# EAGLE schematic Shruthi-Analog-CS80-SVF-v01_xml (EAGLE 7.3.0)
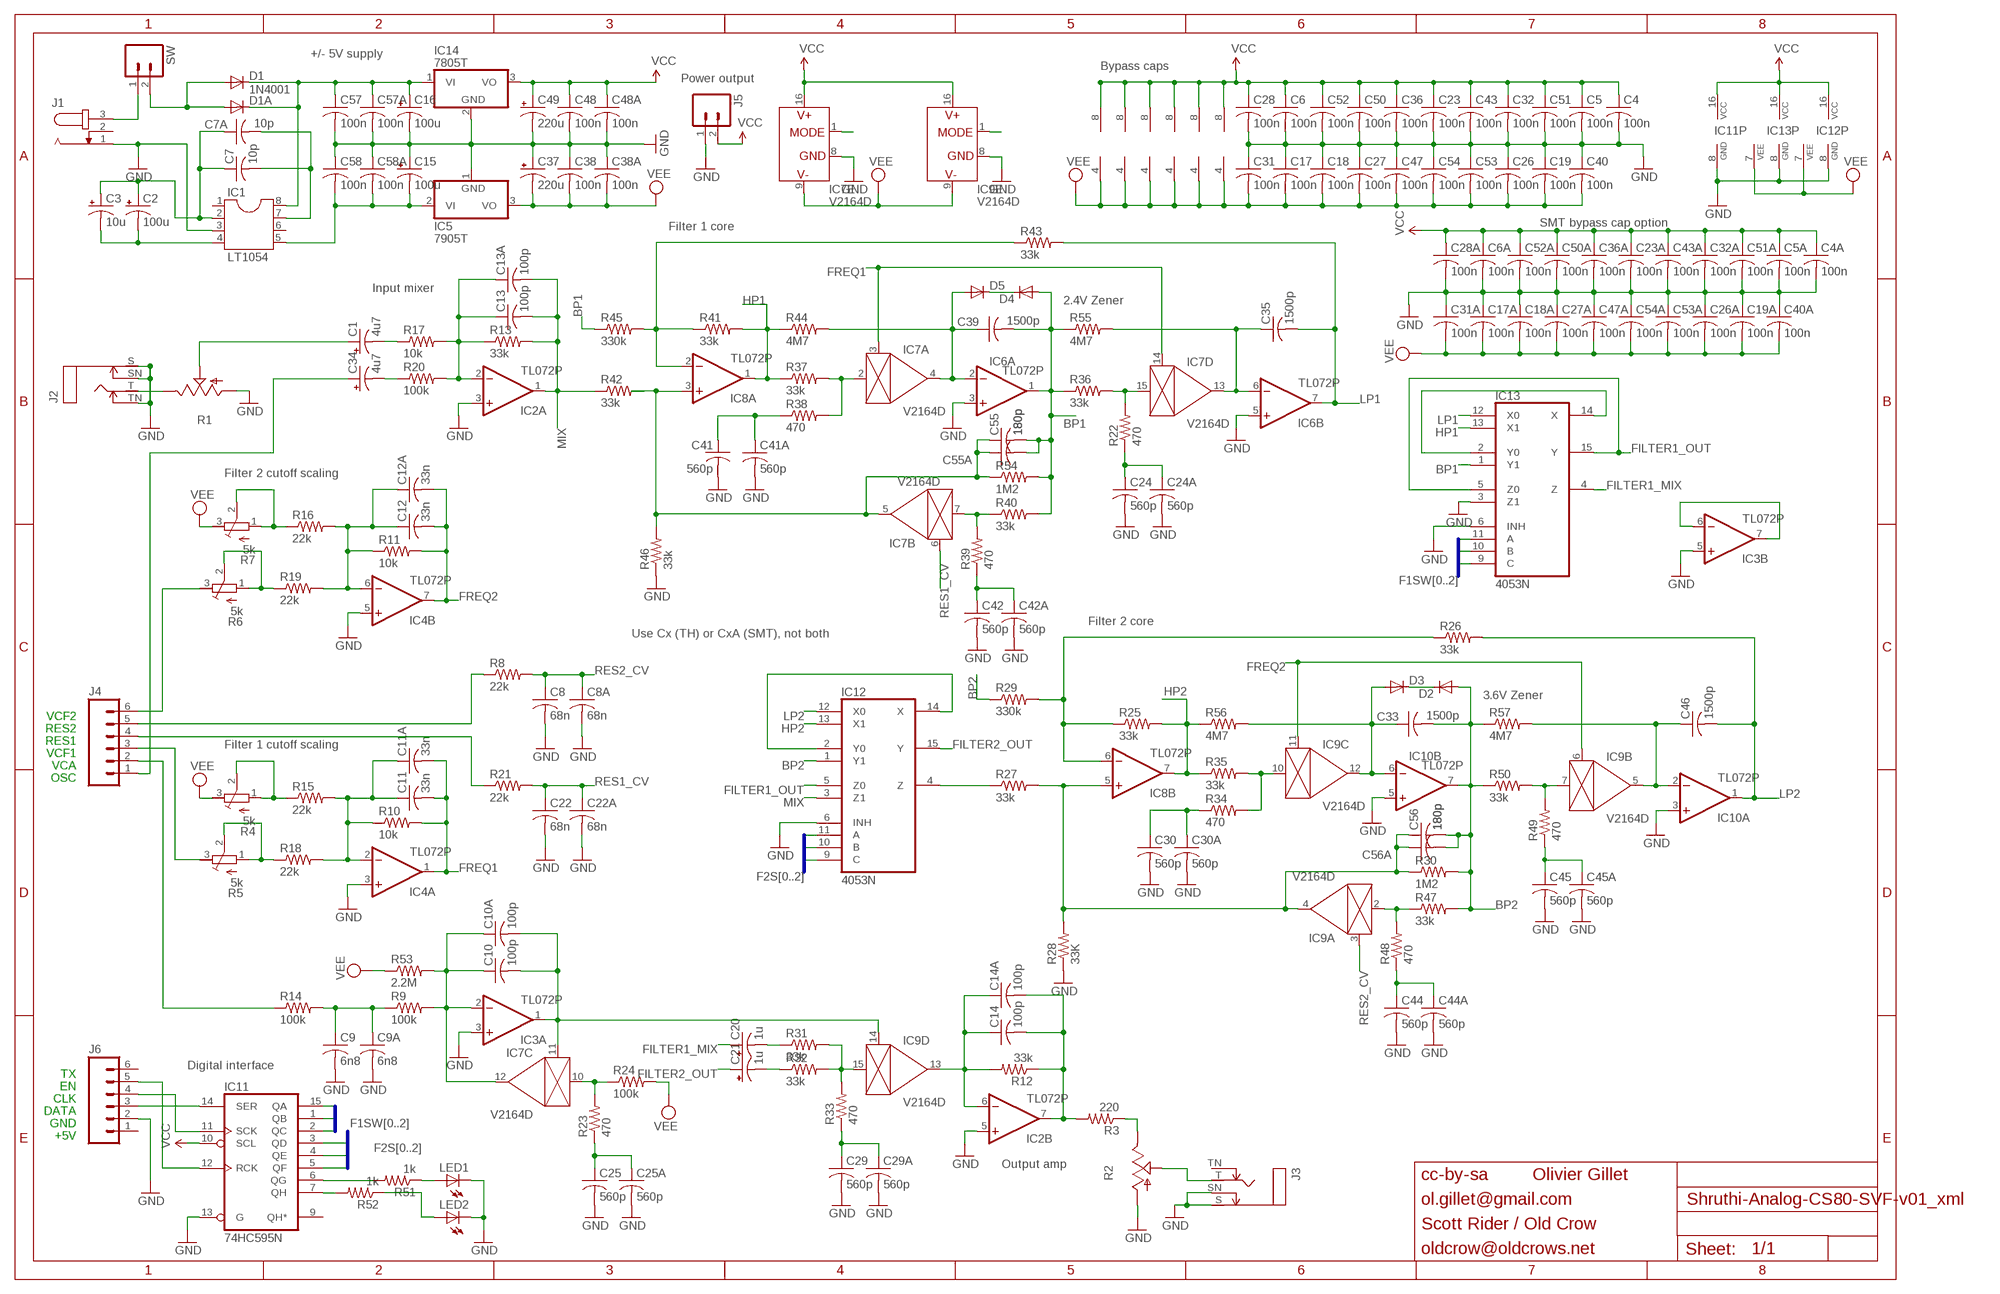
[diagram p0: schematic, sheet 1]

## Parts
C1  4u7  CPOL-USE2.5-6  [E2,5-6]
C2  100u  CPOL-USE2.5-6  [E2,5-6]
C3  10u  CPOL-USE2.5-5  [E2,5-5]
C4  100n  C-US050-025X075  [C050-025X075]
C4A  100n  C-USC0805K  [C0805K]
C5  100n  C-US050-025X075  [C050-025X075]
C5A  100n  C-USC0805K  [C0805K]
C6  100n  C-US050-025X075  [C050-025X075]
C6A  100n  C-USC0805K  [C0805K]
C7  10p  C-US050-025X075  [C050-025X075]
C7A  10p  C-USC0805K  [C0805K]
C8  68n  C-US050-025X075  [C050-025X075]
C8A  68n  C-USC0805K  [C0805K]
C9  6n8  C-US050-025X075  [C050-025X075]
C9A  6n8  C-USC0805K  [C0805K]
C10  100p  C-US050-025X075  [C050-025X075]
C10A  100p  C-USC0805K  [C0805K]
C11  33n  C-US050-025X075  [C050-025X075]
C11A  33n  C-USC0805K  [C0805K]
C12  33n  C-US050-025X075  [C050-025X075]
C12A  33n  C-USC0805K  [C0805K]
C13  100p  C-US050-025X075  [C050-025X075]
C13A  100p  C-USC0805K  [C0805K]
C14  100p  C-US050-025X075  [C050-025X075]
C14A  100p  C-USC0805K  [C0805K]
C15  100u  CPOL-USE2.5-7  [E2,5-7]
C16  100u  CPOL-USE2.5-7  [E2,5-7]
C17  100n  C-US050-025X075  [C050-025X075]
C17A  100n  C-USC0805K  [C0805K]
C18  100n  C-US050-025X075  [C050-025X075]
C18A  100n  C-USC0805K  [C0805K]
C19  100n  C-US050-025X075  [C050-025X075]
C19A  100n  C-USC0805K  [C0805K]
C20  1u  CPOL-USE2-5  [E2-5]
C21  1u  CPOL-USE2-5  [E2-5]
C22  68n  C-US050-025X075  [C050-025X075]
C22A  68n  C-USC0805K  [C0805K]
C23  100n  C-US050-025X075  [C050-025X075]
C23A  100n  C-USC0805K  [C0805K]
C24  560p  C-US050-025X075  [C050-025X075]
C24A  560p  C-USC0805K  [C0805K]
C25  560p  C-US050-025X075  [C050-025X075]
C25A  560p  C-USC0805K  [C0805K]
C26  100n  C-US050-025X075  [C050-025X075]
C26A  100n  C-USC0805K  [C0805K]
C27  100n  C-US050-025X075  [C050-025X075]
C27A  100n  C-USC0805K  [C0805K]
C28  100n  C-US050-025X075  [C050-025X075]
C28A  100n  C-USC0805K  [C0805K]
C29  560p  C-US050-025X075  [C050-025X075]
C29A  560p  C-USC0805K  [C0805K]
C30  560p  C-US050-025X075  [C050-025X075]
C30A  560p  C-USC0805K  [C0805K]
C31  100n  C-US050-025X075  [C050-025X075]
C31A  100n  C-USC0805K  [C0805K]
C32  100n  C-US050-025X075  [C050-025X075]
C32A  100n  C-USC0805K  [C0805K]
C33  1500p  C-US025-025X050  [C025-025X050]
C34  4u7  CPOL-USE2.5-6  [E2,5-6]
C35  1500p  C-US025-025X050  [C025-025X050]
C36  100n  C-US050-025X075  [C050-025X075]
C36A  100n  C-USC0805K  [C0805K]
C37  220u  CPOL-USE3.5-8  [E3,5-8]
C38  100n  C-US050-025X075  [C050-025X075]
C38A  100n  C-USC0805K  [C0805K]
C39  1500p  C-US025-025X050  [C025-025X050]
C40  100n  C-US050-025X075  [C050-025X075]
C40A  100n  C-USC0805K  [C0805K]
C41  560p  C-US050-025X075  [C050-025X075]
C41A  560p  C-USC0805K  [C0805K]
C42  560p  C-US050-025X075  [C050-025X075]
C42A  560p  C-USC0805K  [C0805K]
C43  100n  C-US050-025X075  [C050-025X075]
C43A  100n  C-USC0805K  [C0805K]
C44  560p  C-US050-025X075  [C050-025X075]
C44A  560p  C-USC0805K  [C0805K]
C45  560p  C-US050-025X075  [C050-025X075]
C45A  560p  C-USC0805K  [C0805K]
C46  1500p  C-US025-025X050  [C025-025X050]
C47  100n  C-US050-025X075  [C050-025X075]
C47A  100n  C-USC0805K  [C0805K]
C48  100n  C-US050-025X075  [C050-025X075]
C48A  100n  C-USC0805K  [C0805K]
C49  220u  CPOL-USE3.5-8  [E3,5-8]
C50  100n  C-US050-025X075  [C050-025X075]
C50A  100n  C-USC0805K  [C0805K]
C51  100n  C-US050-025X075  [C050-025X075]
C51A  100n  C-USC0805K  [C0805K]
C52  100n  C-US050-025X075  [C050-025X075]
C52A  100n  C-USC0805K  [C0805K]
C53  100n  C-US025-025X050  [C025-025X050]
C53A  100n  C-USC0805K  [C0805K]
C54  100n  C-US050-025X075  [C050-025X075]
C54A  100n  C-USC0805K  [C0805K]
C55  180p  C-US050-025X075  [C050-025X075]
C55A  180p  C-USC0805K  [C0805K]
C56  180p  C-US050-025X075  [C050-025X075]
C56A  180p  C-USC0805K  [C0805K]
C57  100n  C-US050-025X075  [C050-025X075]
C57A  100n  C-USC0805K  [C0805K]
C58  100n  C-US050-025X075  [C050-025X075]
C58A  100n  C-USC0805K  [C0805K]
D1  1N4001  1N4004  [DO41-10]
D1A  DIODE-SMB  [SMB]
D2  DIODE-D-5  [D-5]
D3  DIODE-D-5  [D-5]
D4  DIODE-D-5  [D-5]
D5  DIODE-D-5  [D-5]
IC1  LT1054  DIL8  [DIL08]
IC2  TL072P  [DIL08]
IC3  TL072P  [DIL08]
IC4  TL072P  [DIL08]
IC5  7905T  [TO220H]
IC6  TL072P  [DIL08]
IC7  V2164D  SSM2164P  [DIL16]
IC8  TL072P  [DIL08]
IC9  V2164D  SSM2164P  [DIL16]
IC10  TL072P  [DIL08]
IC11  74HC595N  [DIL16]
IC12  4053N  [DIL16]
IC13  4053N  [DIL16]
IC14  7805T  [TO220H]
J1  JACK-PLUG2  [SPC4078_BIG_HOLES]
J2  MONOSWS  [NMJ4HC-S]
J3  MONOSWS  [NMJ4HC-S]
J4  M06SIP  [1X06]
J5  M02PTH  [1X02]
J6  M06SIP  [1X06]
LED1  LEDCHIP-LED0603  [CHIP-LED0603]
LED2  LEDCHIP-LED0603  [CHIP-LED0603]
R1  POT_USCABLED  [CABLE_POT_6MM]
R2  POT_USCABLED  [CABLE_POT_6MM]
R3  220  R-US_0204/7  [0204/7]
R4  5k  R-TRIMM3296X  [RTRIM3296X]
R5  5k  R-TRIMM3296X  [RTRIM3296X]
R6  5k  R-TRIMM3296X  [RTRIM3296X]
R7  5k  R-TRIMM3296X  [RTRIM3296X]
R8  22k  R-US_0204/7  [0204/7]
R9  100k  R-US_0204/7  [0204/7]
R10  10k  R-US_0204/7  [0204/7]
R11  10k  R-US_0204/7  [0204/7]
R12  33k  R-US_0204/7  [0204/7]
R13  33k  R-US_0204/7  [0204/7]
R14  100k  R-US_0204/7  [0204/7]
R15  22k  R-US_0204/7  [0204/7]
R16  22k  R-US_0204/7  [0204/7]
R17  10k  R-US_0204/7  [0204/7]
R18  22k  R-US_0204/7  [0204/7]
R19  22k  R-US_0204/7  [0204/7]
R20  100k  R-US_0204/7  [0204/7]
R21  22k  R-US_0204/7  [0204/7]
R22  470  R-US_0204/7  [0204/7]
R23  470  R-US_0204/7  [0204/7]
R24  100k  R-US_0204/7  [0204/7]
R25  33k  R-US_0204/7  [0204/7]
R26  33k  R-US_0204/7  [0204/7]
R27  33k  R-US_0204/7  [0204/7]
R28  33K  R-US_0204/7  [0204/7]
R29  330k  R-US_0204/7  [0204/7]
R30  1M2  R-US_0204/7  [0204/7]
R31  33k  R-US_0204/7  [0204/7]
R32  33k  R-US_0204/7  [0204/7]
R33  470  R-US_0204/7  [0204/7]
R34  470  R-US_0204/7  [0204/7]
R35  33k  R-US_0204/7  [0204/7]
R36  33k  R-US_0204/7  [0204/7]
R37  33k  R-US_0204/7  [0204/7]
R38  470  R-US_0204/7  [0204/7]
R39  470  R-US_0204/7  [0204/7]
R40  33k  R-US_0204/7  [0204/7]
R41  33k  R-US_0204/7  [0204/7]
R42  33k  R-US_0204/7  [0204/7]
R43  33k  R-US_0204/7  [0204/7]
R44  4M7  R-US_0204/7  [0204/7]
R45  330k  R-US_0204/7  [0204/7]
R46  33k  R-US_0204/7  [0204/7]
R47  33k  R-US_0204/7  [0204/7]
R48  470  R-US_0204/7  [0204/7]
R49  470  R-US_0204/7  [0204/7]
R50  33k  R-US_0204/7  [0204/7]
R51  1k  R-US_0204/7  [0204/7]
R52  1k  R-US_0204/7  [0204/7]
R53  2.2M  R-US_0204/2V  [0204V]
R54  1M2  R-US_0204/7  [0204/7]
R55  4M7  R-US_0204/7  [0204/7]
R56  4M7  R-US_0204/7  [0204/7]
R57  4M7  R-US_0204/7  [0204/7]
SW  M02PTH  [1X02]

## Nets
BP1: C39.2 C55.2 C55A.2 D4.A IC6.1(A:OUT) IC13.1(Y1) R36.1 R40.2 R45.1 R54.2 R55.1
BP2: C33.2 C56.2 C56A.2 D2.A IC10.7(B:OUT) IC12.1(Y1) R29.1 R30.2 R47.2 R50.1 R57.1
F1SW0: IC11.15(QA) IC13.9(C)
F1SW1: IC11.1(QB) IC13.10(B)
F1SW2: IC11.2(QC) IC13.11(A)
F2SW0: IC11.3(QD) IC12.9(C)
F2SW1: IC11.4(QE) IC12.10(B)
F2SW2: IC11.5(QF) IC12.11(A)
FILTER1_MIX: C20.+ IC13.4(Z)
FILTER1_OUT: IC12.5(Z0) IC13.5(Z0) IC13.15(Y)
FILTER2_OUT: C21.+ IC12.15(Y)
FREQ1: C11.2 C11A.2 IC4.1(A:OUT) IC7.3(A:CTRL) IC7.14(D:CTRL) R10.2
FREQ2: C12.2 C12A.2 IC4.7(B:OUT) IC9.6(B:CTRL) IC9.11(C:CTRL) R11.2
GND: C4.2 C4A.2 C5.2 C5A.2 C6.2 C6A.2 C8.2 C8A.2 C9.2 C9A.2 C15.+ C16.- C17.1 C17A.1 C18.1 C18A.1 C19.1 C19A.1 C22.2 C22A.2 C23.2 C23A.2 C24.2 C24A.2 C25.2 C25A.2 C26.1 C26A.1 C27.1 C27A.1 C28.2 C28A.2 C29.2 C29A.2 C30.2 C30A.2 C31.1 C31A.1 C32.2 C32A.2 C36.2 C36A.2 C37.+ C38.1 C38A.1 C40.1 C40A.1 C41.2 C41A.2 C42.2 C42A.2 C43.2 C43A.2 C44.2 C44A.2 C45.2 C45A.2 C47.1 C47A.1 C48.2 C48A.2 C49.- C50.2 C50A.2 C51.2 C51A.2 C52.2 C52A.2 C53.1 C53A.1 C54.1 C54A.1 C57.2 C57A.2 C58.1 C58A.1 IC1.3 IC2.3(A:+IN) IC2.5(B:+IN) IC3.3(A:+IN) IC3.5(B:+IN) IC4.3(A:+IN) IC4.5(B:+IN) IC5.1(GND) IC6.3(A:+IN) IC6.5(B:+IN) IC7.8(E:GND) IC9.8(E:GND) IC10.3(A:+IN) IC10.5(B:+IN) IC11.8(GND) IC11.13(G) IC12.6(INH) IC12.8(GND) IC13.3(Z1) IC13.6(INH) IC13.8(GND) IC14.2(GND) J1.1 J2.S J2.SN J2.TN J3.S J3.SN J5.1 J6.2 LED1.C LED2.C R1.A R2.A R28.1 R46.1
HP1: IC8.1(A:OUT) IC13.13(X1) R37.1 R41.2 R44.1
HP2: IC8.7(B:OUT) IC12.13(X1) R25.2 R35.1 R56.1
LP1: C35.2 IC6.7(B:OUT) IC13.12(X0) R43.2
LP2: C46.2 IC10.1(A:OUT) IC12.12(X0) R26.2
MIX: C13.2 C13A.2 IC2.1(A:OUT) IC12.3(Z1) R13.2 R42.1
N$1: C2.+ C3.+ C7.1 C7A.1 IC1.2
N$2: C12.1 C12A.1 IC4.6(B:-IN) R11.1 R16.2 R19.2
N$3: J1.3 SW.1
N$4: C16.+ C57.1 C57A.1 D1.C D1A.C IC1.8 IC14.1(VI)
N$5: C2.- C3.- IC1.4
N$6: C13.1 C13A.1 IC2.2(A:-IN) R13.1 R17.2 R20.2
N$7: R6.1(E) R6.2(S) R19.1
N$8: J4.6 R6.3(A)
N$9: R7.1(E) R7.2(S) R16.1
N$10: IC7.10(C:IN) R23.2 R24.1
N$11: C10.1 C10A.1 IC3.2(A:-IN) IC7.12(C:OUT) R9.2 R53.2
N$12: IC8.2(A:-IN) R41.1 R43.1 R45.2
N$13: IC11.12(RCK) J6.5
N$14: IC11.14(SER) J6.3
N$15: IC11.6(QG) R51.2
N$16: IC11.11(SCK) J6.4
N$17: C24.1 C24A.1 R22.1
N$18: IC8.6(B:-IN) R25.1 R26.1 R29.2
N$19: C39.1 D5.A IC6.2(A:-IN) IC7.4(A:OUT) R44.2
N$20: C33.1 D3.A IC9.12(C:OUT) IC10.6(B:-IN) R56.2
N$21: IC7.7(B:IN) R39.2 R40.1
N$22: C9.1 C9A.1 R9.1 R14.2
N$23: C56.1 C56A.1 IC8.5(B:+IN) IC9.4(A:OUT) R27.2 R28.2 R30.1
N$24: IC9.2(A:IN) R47.1 R48.2
N$25: R2.E R3.1
N$26: IC7.15(D:IN) R22.2 R36.2
N$27: C42.1 C42A.1 R39.1
N$28: C35.1 IC6.6(B:-IN) IC7.13(D:OUT) R55.2
N$29: IC7.2(A:IN) R37.2 R38.2
N$30: C41.1 C41A.1 R38.1
N$31: C55.1 C55A.1 IC7.5(B:OUT) IC8.3(A:+IN) R42.2 R46.2 R54.1
N$32: LED1.A R51.1
N$33: D2.C D3.C
N$34: IC9.7(B:IN) R49.2 R50.2
N$35: C34.+ J4.1
N$36: C7.2 C7A.2 IC1.7
N$38: J2.T R1.E
N$39: C34.- R20.1
N$40: C11.1 C11A.1 IC4.2(A:-IN) R10.1 R15.2 R18.2
N$41: R5.1(E) R5.2(S) R18.1
N$42: J4.3 R5.3(A)
N$43: R4.1(E) R4.2(S) R15.1
N$44: C46.1 IC9.5(B:OUT) IC10.2(A:-IN) R57.2
N$45: J4.2 R14.1
N$46: C45.1 C45A.1 R49.1
N$47: J3.T R2.S
N$49: C44.1 C44A.1 R48.1
N$50: IC9.10(C:IN) R34.2 R35.2
N$51: C30.1 C30A.1 R34.1
N$52: LED2.A R52.1
N$53: IC11.7(QH) R52.2
N$55: D4.C D5.C
N$56: C10.2 C10A.2 IC3.1(A:OUT) IC7.11(C:CTRL) IC9.14(D:CTRL)
N$57: C20.- R31.1
N$58: C15.- C58.2 C58A.2 IC1.5 IC5.2(VI)
N$59: D1.A D1A.A SW.2
N$60: C21.- R32.1
N$61: IC3.6(B:-IN) IC3.7(B:OUT)
N$62: IC13.2(Y0) IC13.14(X)
N$63: C14.2 C14A.2 IC2.7(B:OUT) R3.2 R12.1
N$64: C25.1 C25A.1 R23.1
N$65: C29.1 C29A.1 R33.1
N$66: C1.+ R1.S
N$67: IC9.15(D:IN) R31.2 R32.2 R33.2
N$68: IC7.1(E:MODE)
N$69: J4.4 R21.1
N$70: C14.1 C14A.1 IC2.6(B:-IN) IC9.13(D:OUT) R12.2
N$71: IC9.1(E:MODE)
N$72: C1.- R17.1
N$73: J4.5 R8.1
N$74: IC12.2(Y0) IC12.14(X)
N$75: IC12.4(Z) R27.1
RES1_CV: C22.1 C22A.1 IC7.6(B:CTRL) R21.2
RES2_CV: C8.1 C8A.1 IC9.3(A:CTRL) R8.2
VCC: C4.1 C4A.1 C5.1 C5A.1 C6.1 C6A.1 C23.1 C23A.1 C28.1 C28A.1 C32.1 C32A.1 C36.1 C36A.1 C43.1 C43A.1 C48.1 C48A.1 C49.+ C50.1 C50A.1 C51.1 C51A.1 C52.1 C52A.1 IC2.8(P:V+) IC3.8(P:V+) IC4.8(P:V+) IC6.8(P:V+) IC7.16(E:V+) IC8.8(P:V+) IC9.16(E:V+) IC10.8(P:V+) IC11.10(SCL) IC11.16(VCC) IC12.16(VCC) IC13.16(VCC) IC14.3(VO) J5.2
VEE: C17.2 C17A.2 C18.2 C18A.2 C19.2 C19A.2 C26.2 C26A.2 C27.2 C27A.2 C31.2 C31A.2 C37.- C38.2 C38A.2 C40.2 C40A.2 C47.2 C47A.2 C53.2 C53A.2 C54.2 C54A.2 IC2.4(P:V-) IC3.4(P:V-) IC4.4(P:V-) IC5.3(VO) IC6.4(P:V-) IC7.9(E:V-) IC8.4(P:V-) IC9.9(E:V-) IC10.4(P:V-) IC12.7(VEE) IC13.7(VEE) R4.3(A) R7.3(A) R24.2 R53.1
Unconnected: IC1.1 IC1.6 IC11.9(QH*) J1.2 J3.TN J6.1 J6.6

## Buses
F1SW[0..2]
F2S[0..2]

## Notes on the sheet
- +/- 5V supply
- Bypass caps
- Power output
- SMT bypass cap option
- Filter 1 core
- Input mixer
- 2.4V Zener
- Filter 2 cutoff scaling
- Filter 2 core
- Use Cx (TH) or CxA (SMT), not both
- 3.6V Zener
- VCF2
- RES2
- RES1
- VCF1 | Filter 1 cutoff scaling
- VCA
- OSC
- TX | Digital interface
- EN
- CLK
- DATA
- GND
- +5V
- Output amp
- cc-by-sa | Olivier Gillet
- ol.gillet@gmail.com
- Scott Rider / Old Crow
- oldcrow@oldcrows.net

## Library data of the parts
C1-C3 C15 C16 C20 C21 C34 C37 C49 = rcl:CPOL-US: POLARIZED CAPACITOR, American symbol
C4 C4A C5 C5A C6 C6A C7 C7A C8 C8A C9 C9A C10 C10A C11 C11A C12 C12A C13 C13A C14 C14A C17 C17A C18 C18A C19 C19A C22 C22A C23 C23A C24 C24A C25 C25A C26 C26A C27 C27A C28 C28A C29 C29A C30 C30A C31 C31A C32 C32A C33 C35 C36 C36A C38 C38A C39 C40 C40A C41 C41A C42 C42A C43 C43A C44 C44A C45 C45A C46 C47 C47A C48 C48A C50 C50A C51 C51A C52 C52A C53 C53A C54 C54A C55 C55A C56 C56A C57 C57A C58 C58A = rcl:C-US: CAPACITOR, American symbol
D1 = diode:1N4004: DIODE general purpose rectifier, 1 A
D1A D2-D5 = diode:DIODE-: DIODE
IC1 = ic-package:DIL8: Dual In Line / Socket
IC2-IC4 IC6 IC8 IC10 = og-linear:TL072: OP AMP
IC5 = linear:79*: Negative VOLTAGE REGULATOR
IC7 IC9 = ssm2164:SSM2164
IC11 = 74xx-eu:74*595: 8-bit SHIFT REGISTER, output latch
IC12 IC13 = 40xx:4053: Triple 2-channel ANALOG MULTIPLEXER
IC14 = linear:78*: Positive VOLTAGE REGULATOR Source: http://cache.national.com/ds/LM/LM78L05.pdf http://www.fairchildsemi.com/ds/LM/LM7805.pdf
J1 = con-jack2:JACK-PLUG: DC POWER JACK Power Jack, DC, Right Angle, Through Hole, Rated 5A at 16VDC, PC Terminals Distributor: Farnell (www.Farnell.de) Drawing: 84N1161.pdf / 84N1162.pdf Manufacturer: SPC Technology (www.spctechnology.com) Type: SPC4077 / SPC 4078
J2 J3 = gm-jacks:MONOSW
J4 J6 = SparkFun:M06: Header 6 Standard 6-pin 0.1" header. Use with straight break away headers (SKU : PRT-00116), right angle break away headers (PRT-00553), swiss pins (PRT-00743), machine pins (PRT-00117), and female headers (PRT-00115). Molex polarized connector foot print use with SKU : PRT-08094 with associated crimp pins and housings. NOTES ON THE VARIANTS LOCK and LOCK_LONGPADS... This footprint was designed to help hold the alignment of a through-hole component (i.e. 6-pin header) while soldering it into place. You may notice that each hole has been shifted either up or down by 0.005 of an inch from it's more standard position (which is a perfectly straight line). This slight alteration caused the pins (the squares in the middle) to touch the edges of the holes. Because they are alternating, it causes a "brace" to hold the component in place. 0.005 has proven to be the perfect amount of "off-center" position when using our standard breakaway headers. Although looks a little odd when you look at the bare footprint, once you have a header in there, the alteration is very hard to notice. Also, if you push a header all the way into place, it is covered up entirely on the bottom side. This idea of altering the position of holes to aid alignment will be further integrated into the Sparkfun Library for other footprints. It can help hold any component with 3 or more connection pins.
J5 SW = SparkFun:M02: Header 2 Standard 2-pin 0.1" header. Use with straight break away headers (SKU : PRT-00116), right angle break away headers (PRT-00553), swiss pins (PRT-00743), machine pins (PRT-00117), and female headers (PRT-00115). Molex polarized connector foot print use with SKU : PRT-08233 with associated crimp pins and housings.
LED1 LED2 = led:LED: LED OSRAM: - CHIPLED LG R971, LG N971, LY N971, LG Q971, LY Q971, LO R971, LY R971 LH N974, LH R974 LS Q976, LO Q976, LY Q976 LO Q996 - Hyper CHIPLED LW Q18S LB Q993, LB Q99A, LB R99A - SideLED LS A670, LO A670, LY A670, LG A670, LP A670 LB A673, LV A673, LT A673, LW A673 LH A674 LY A675 LS A676, LA A676, LO A676, LY A676, LW A676 LS A679, LY A679, LG A679 - Hyper Micro SIDELED® LS Y876, LA Y876, LO Y876, LY Y876 LT Y87S - SmartLED LW L88C, LW L88S LB L89C, LB L89S, LG L890 LS L89K, LO L89K, LY L89K LS L896, LA L896, LO L896, LY L896 - TOPLED LS T670, LO T670, LY T670, LG T670, LP T670 LSG T670, LSP T670, LSY T670, LOP T670, LYG T670 LG T671, LOG T671, LSG T671 LB T673, LV T673, LT T673, LW T673 LH T674 LS T676, LA T676, LO T676, LY T676, LB T676, LH T676, LSB T676, LW T676 LB T67C, LV T67C, LT T67C, LS T67K, LO T67K, LY T67K, LW E67C LS E67B, LA E67B, LO E67B, LY E67B, LB E67C, LV E67C, LT E67C LW T67C LS T679, LY T679, LG T679 LS T770, LO T770, LY T770, LG T770, LP T770 LB T773, LV T773, LT T773, LW T773 LH T774 LS E675, LA E675, LY E675, LS T675 LS T776, LA T776, LO T776, LY T776, LB T776 LHGB T686 LT T68C, LB T68C - Hyper Mini TOPLED® LB M676 - Mini TOPLED Santana® LG M470 LS M47K, LO M47K, LY M47K Source: http://www.osram.convergy.de LUXEON: - LUMILED® LXK2-PW12-R00, LXK2-PW12-S00, LXK2-PW14-U00, LXK2-PW14-V00 LXK2-PM12-R00, LXK2-PM12-S00, LXK2-PM14-U00 LXK2-PE12-Q00, LXK2-PE12-R00, LXK2-PE12-S00, LXK2-PE14-T00, LXK2-PE14-U00 LXK2-PB12-K00, LXK2-PB12-L00, LXK2-PB12-M00, LXK2-PB14-N00, LXK2-PB14-P00, LXK2-PB14-Q00 LXK2-PR12-L00, LXK2-PR12-M00, LXK2-PR14-Q00, LXK2-PR14-R00 LXK2-PD12-Q00, LXK2-PD12-R00, LXK2-PD12-S00 LXK2-PH12-R00, LXK2-PH12-S00 LXK2-PL12-P00, LXK2-PL12-Q00, LXK2-PL12-R00 Source: www.luxeon.com KINGBRIGHT: KA-3528ASYC Source: www.kingbright.com
R1 R2 = pot-alps:POT_US
R3 R8-R57 = rcl:R-US_: RESISTOR, American symbol
R4-R7 = rcl:R-TRIMM: Trimm resistor